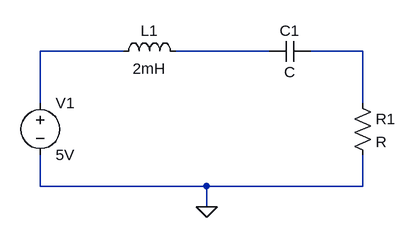
[diagram p0: schematic ms3_second_order_filter.asc]
ms3_second_order_filter.asc, the LTspice schematic file:
Version 4
SHEET 1 880 680
WIRE 224 64 96 64
WIRE 448 64 304 64
WIRE 592 64 512 64
WIRE 96 144 96 64
WIRE 592 144 592 64
WIRE 96 272 96 224
WIRE 352 272 96 272
WIRE 592 272 592 224
WIRE 592 272 352 272
WIRE 352 304 352 272
FLAG 352 304 0
SYMBOL voltage 96 128 R0
SYMATTR InstName V1
SYMATTR Value 5V
SYMBOL ind 208 80 R270
WINDOW 0 32 56 VTop 2
WINDOW 3 5 56 VBottom 2
SYMATTR InstName L1
SYMATTR Value 2mH
SYMBOL cap 512 48 R90
WINDOW 0 0 32 VBottom 2
WINDOW 3 32 32 VTop 2
SYMATTR InstName C1
SYMBOL res 576 128 R0
SYMATTR InstName R1

The netlist it stands for:
* ms3_second_order_filter.asc
V1 N001 0 5V
L1 N001 N002 2mH
C1 N003 N002 C
R1 N003 0 R
.backanno
.end